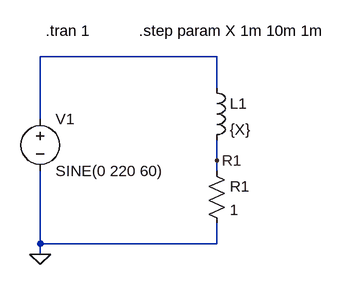
[diagram p0: schematic energy_calc.asc]
energy_calc.asc, the LTspice schematic file:
Version 4
SHEET 1 880 680
WIRE 288 160 16 160
WIRE 288 208 288 160
WIRE 16 256 16 160
WIRE 288 320 288 288
WIRE 288 336 288 320
WIRE 16 448 16 336
WIRE 288 448 288 416
WIRE 288 448 16 448
WIRE 16 464 16 448
FLAG 16 464 0
FLAG 288 320 R1
SYMBOL res 272 320 R0
SYMATTR InstName R1
SYMATTR Value 1
SYMBOL voltage 16 240 R0
SYMATTR InstName V1
SYMATTR Value SINE(0 220 60)
SYMBOL ind 272 192 R0
SYMATTR InstName L1
SYMATTR Value {X}
TEXT 24 120 Left 2 !.tran 1
TEXT 168 120 Left 2 !.step param X 1m 10m 1m

The netlist it stands for:
* energy_calc.asc
R1 R1 0 1
V1 N001 0 SINE(0 220 60)
L1 N001 R1 {X}
.tran 1
.step param X 1m 10m 1m
.backanno
.end